# Altium schematic sheet LED .SchDoc
size A4
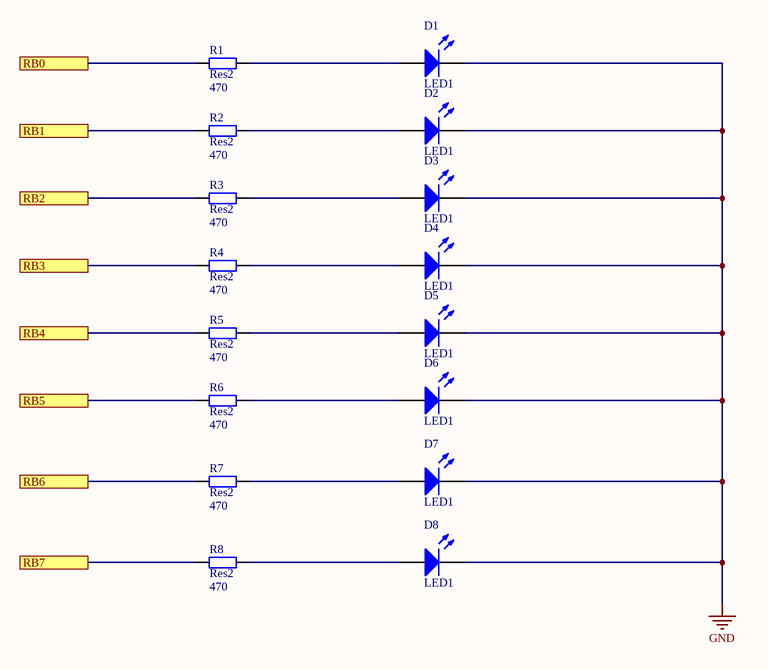
[diagram p0: LED .SchDoc]

## Parts
D1  LED1  [LED-1]
D2  LED1  [LED-1]
D3  LED1  [LED-1]
D4  LED1  [LED-1]
D5  LED1  [LED-1]
D6  LED1  [LED-1]
D7  LED1  [LED-1]
D8  LED1  [LED-1]
R1  Res2  value 470  [AXIAL-0.4]
R2  Res2  value 470  [AXIAL-0.4]
R3  Res2  value 470  [AXIAL-0.4]
R4  Res2  value 470  [AXIAL-0.4]
R5  Res2  value 470  [AXIAL-0.4]
R6  Res2  value 470  [AXIAL-0.4]
R7  Res2  value 470  [AXIAL-0.4]
R8  Res2  value 470  [AXIAL-0.4]

## Ports
RB0, RB1, RB2, RB3, RB4, RB5, RB6, RB7

## Nets
GND: D1.2(K) D2.2(K) D3.2(K) D4.2(K) D5.2(K) D6.2(K) D7.2(K) D8.2(K)
RB0: R1.1 ; port RB0
RB1: R2.1 ; port RB1
RB2: R3.1 ; port RB2
RB3: R4.1 ; port RB3
RB4: R5.1 ; port RB4
RB5: R6.1 ; port RB5
RB6: R7.1 ; port RB6
RB7: R8.1 ; port RB7
NetD1_1: D1.1(A) R1.2
NetD2_1: D2.1(A) R2.2
NetD3_1: D3.1(A) R3.2
NetD4_1: D4.1(A) R4.2
NetD5_1: D5.1(A) R5.2
NetD6_1: D6.1(A) R6.2
NetD7_1: D7.1(A) R7.2
NetD8_1: D8.1(A) R8.2

## Library data of the parts
D1-D8 = LED1: Typical RED GaAs LED; Published: 8-Jun-2000; LatestRevisionDate: 08-Jul-2005; LatestRevisionNote: Mech Layer 1 removed.; PackageReference: LED-1; Publisher: Altium Limited; PackageDescription: LED; 2 Leads
R1-R8 = Res2: Resistor; Published: 8-Jun-2000; LatestRevisionDate: 17-Jul-2002; LatestRevisionNote: Re-released for DXP Platform.; PackageReference: AXIAL-0.4; Publisher: Altium Limited; PackageDescription: Axial Device, Thru-Hole; 2 Leads; 0.4 in Pin Spacing